# EAGLE design science arm board (EAGLE 7.4.0)
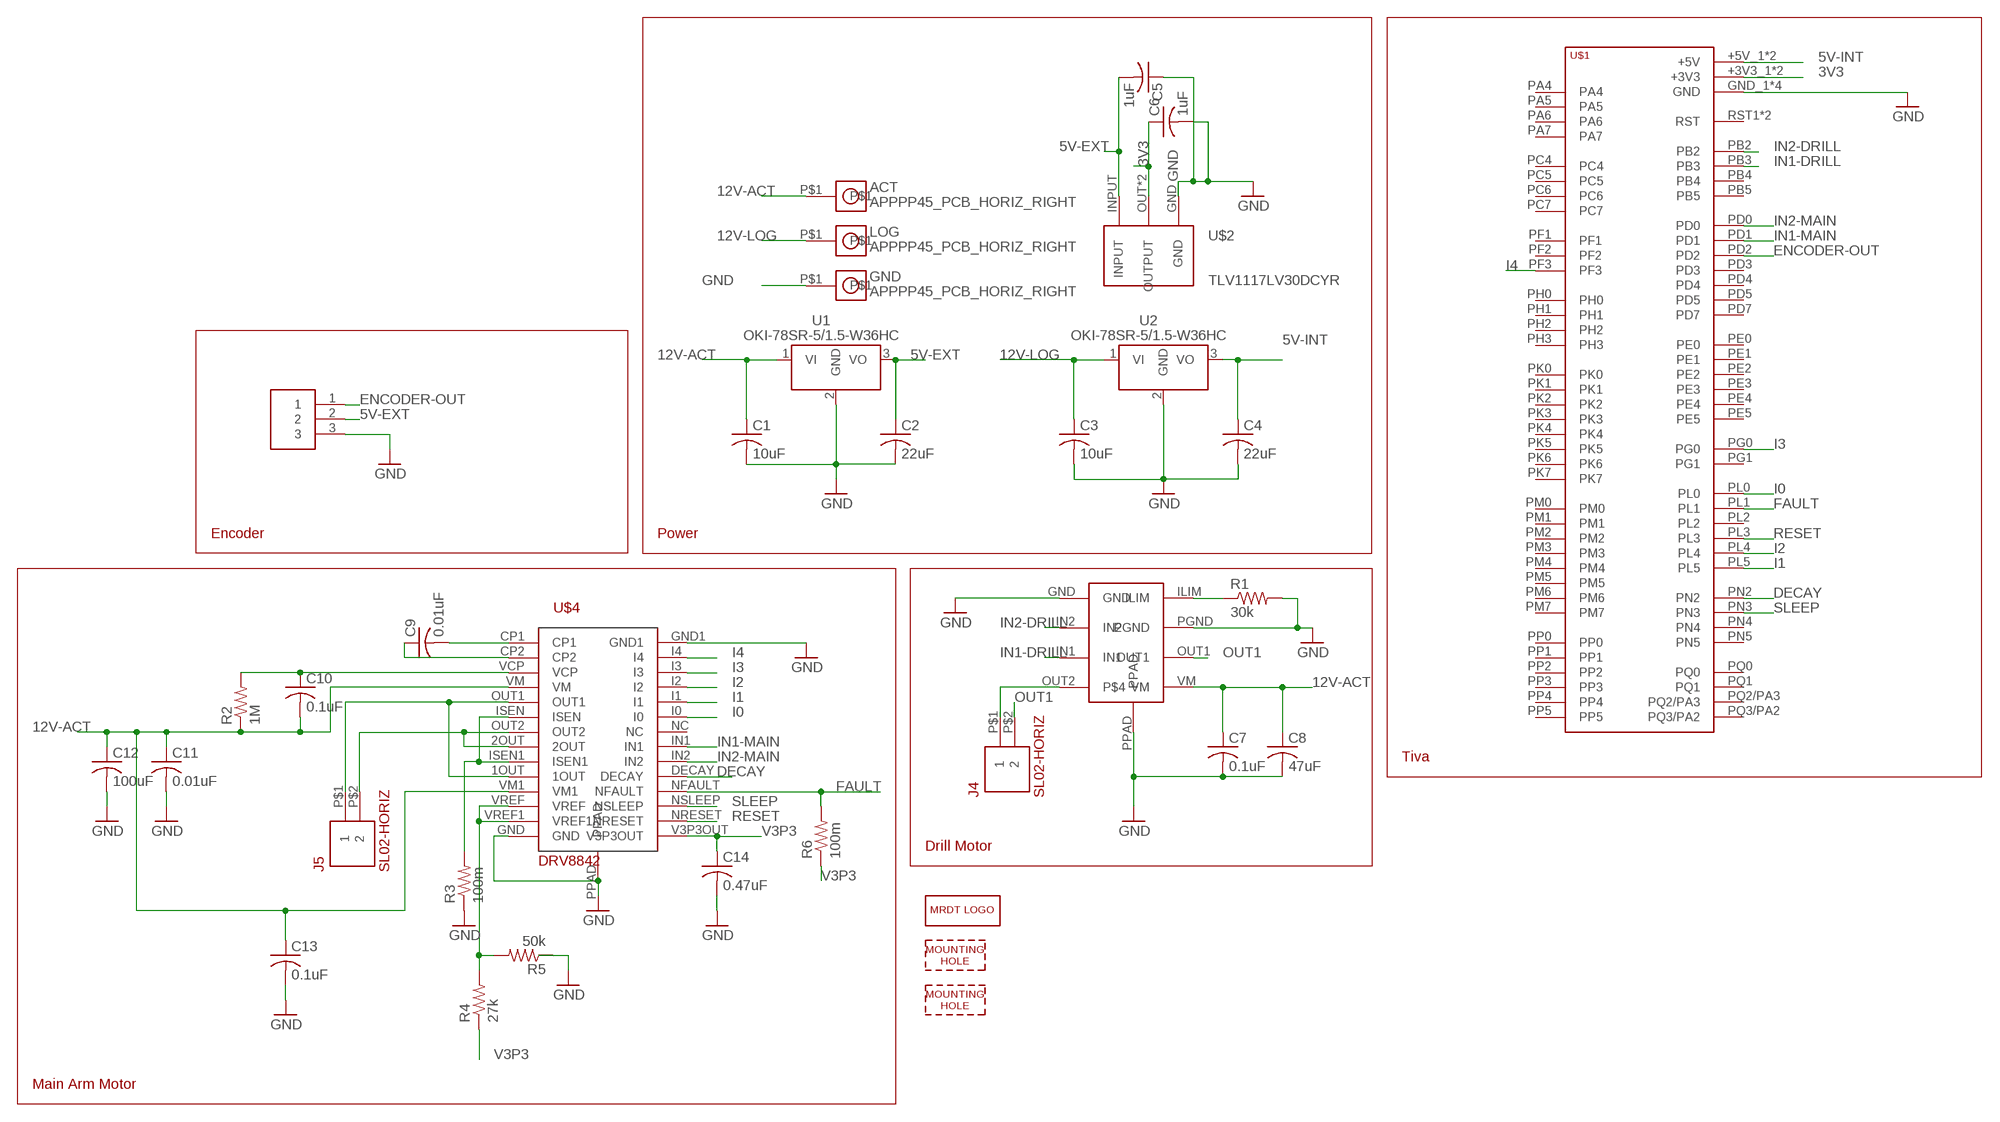
[diagram p0: schematic, sheet 1]

## Parts
ACT  APPPP45_PCB_HORIZ_RIGHT  [APP45_PCB_HORIZ_RIGHT]
C1  10uF  C-USC1206  [C1206]
C2  22uF  C-USC1206  [C1206]
C3  10uF  C-USC1206  [C1206]
C4  22uF  C-USC1206  [C1206]
C5  1uF  C-USC1206  [C1206]
C6  1uF  C-USC1206  [C1206]
C7  0.1uF  C-USC1206  [C1206]
C8  47uF  C-USC1206  [C1206]
C9  0.01uF  C-USC1206  [C1206]
C10  0.1uF  C-USC1206  [C1206]
C11  0.01uF  C-USC1206  [C1206]
C12  100uF  C-USC1206  [C1206]
C13  0.1uF  C-USC1206  [C1206]
C14  0.47uF  C-USC1206  [C1206]
GND  APPPP45_PCB_HORIZ_RIGHT  [APP45_PCB_HORIZ_RIGHT]
H1  MOUNTING_HOLE#6  [#6_SCREW]
H5  MOUNTING_HOLE#6  [#6_SCREW]
J4  SL02-HORIZ  [MOLEX-70551-0001]
J5  SL02-HORIZ  [MOLEX-70551-0001]
J6  SL03THROUGH_HOLE  [MOLEX_SL_03_TH]
LOG  APPPP45_PCB_HORIZ_RIGHT  [APP45_PCB_HORIZ_RIGHT]
LOGO1  MRDT_LOGO  [MRDT_LOGO]
R1  30k  R-US_R0805  [R0805]
R2  1M  R-US_R0805  [R0805]
R3  100m  R-US_R0805  [R0805]
R4  27k  R-US_R0805  [R0805]
R5  50k  R-US_R0805  [R0805]
R6  100m  R-US_R0805  [R0805]
U1  OKI-78SR-5/1.5-W36HC  [OKI-78SR_HORIZ]
U2  OKI-78SR-5/1.5-W36HC  [OKI-78SR_HORIZ]
U$1  TIVA-1294  [TIVA-C-CONNECTED]
U$2  TLV1117LV30DCYR  [TLV1117LV30DCYR]
U$3  DRV8871  [DRV8871]
U$4  DRV8842  [DRV8842]

## Nets
3V3: C6.1 U$1.+3V3_1(+3V3) U$1.+3V3_2(+3V3) U$2.OUT(OUTPUT) U$2.OUTPUT
5V-EXT: C2.1 C5.2 J6.2 U1.3(VO) U$2.INPUT
5V-INT: C4.1 U2.3(VO) U$1.+5V_1(+5V) U$1.+5V_2(+5V)
12V-ACT: ACT.P$1 C1.1 C7.1 C8.1 C10.2 C11.1 C12.1 C13.1 R2.1 U1.1(VI) U$3.VM U$4.VM U$4.VM1
12V-LOG: C3.1 LOG.P$1 U2.1(VI)
DECAY: U$1.PN2 U$4.DECAY
ENCODER-OUT: J6.1 U$1.PD2
FAULT: R6.2 U$1.PL1 U$4.NFAULT
GND: C1.2 C2.2 C3.2 C4.2 C5.1 C6.2 C7.2 C8.2 C11.2 C12.2 C13.2 C14.2 GND.P$1 J6.3 R1.2 R3.1 U1.2(GND) U2.2(GND) U$1.GND_1(GND) U$1.GND_2(GND) U$1.GND_3(GND) U$1.GND_4(GND) U$2.GND U$3.GND U$3.PGND U$3.PPAD U$4.GND U$4.GND1 U$4.PPAD
I0: U$1.PL0 U$4.I0
I1: U$1.PL5 U$4.I1
I2: U$1.PL4 U$4.I2
I3: U$1.PG0 U$4.I3
I4: U$1.PF3 U$4.I4
IN1-DRILL: U$1.PB3 U$3.IN1
IN1-MAIN: U$1.PD1 U$4.IN1
IN2-DRILL: U$1.PB2 U$3.IN2
IN2-MAIN: U$1.PD0 U$4.IN2
N$1: R1.1 U$3.ILIM
N$2: J4.P$1 U$3.OUT2
N$3: R3.2 U$4.ISEN U$4.ISEN1
N$4: J5.P$2 U$4.2OUT U$4.OUT2
N$5: J5.P$1 U$4.1OUT U$4.OUT1
N$6: C9.2 U$4.CP1
N$7: C9.1 U$4.CP2
N$8: C10.1 R2.2 U$4.VCP
N$9: R4.2 R5.2 U$4.VREF U$4.VREF1
OUT1: J4.P$2 U$3.OUT1
RESET: U$1.PL3 U$4.NRESET
SLEEP: U$1.PN3 U$4.NSLEEP
V3P3: C14.1 R4.1 R6.1 U$4.V3P3OUT
Unconnected: R5.1 U$1.PA4 U$1.PA5 U$1.PA6 U$1.PA7 U$1.PB4 U$1.PB5 U$1.PC4 U$1.PC5 U$1.PC6 U$1.PC7 U$1.PD3 U$1.PD4 U$1.PD5 U$1.PD7 U$1.PE0 U$1.PE1 U$1.PE2 U$1.PE3 U$1.PE4 U$1.PE5 U$1.PF1 U$1.PF2 U$1.PG1 U$1.PH0 U$1.PH1 U$1.PH2 U$1.PH3 U$1.PK0 U$1.PK1 U$1.PK2 U$1.PK3 U$1.PK4 U$1.PK5 U$1.PK6 U$1.PK7 U$1.PL2 U$1.PM0 U$1.PM1 U$1.PM2 U$1.PM3 U$1.PM4 U$1.PM5 U$1.PM6 U$1.PM7 U$1.PN4 U$1.PN5 U$1.PP0 U$1.PP1 U$1.PP2 U$1.PP3 U$1.PP4 U$1.PP5 U$1.PQ0 U$1.PQ1 U$1.PQ2/PA3 U$1.PQ3/PA2 U$1.RST1(RST) U$1.RST_2(RST) U$4.NC

## Notes on the sheet
- Encoder | Power
- Tiva
- Drill Motor
- Main Arm Motor

## Library data of the parts
ACT GND LOG = MRDT-Connectors:APP: http://www.powerwerx.com/anderson-powerpoles/
C1-C14 = rcl:C-US: CAPACITOR, American symbol
H1 H5 = MRDT-Hardware:MOUNTING_HOLE: Mounting hole for M6 bolt. Standard use mounting hole for: Tiva C Connected - M6 Anderson Powerpole Mounting Wing - M8 Most frame-mounted PCB's - M8
J4 J5 = MRDT-Connectors:SL02
J6 = MRDT-Connectors:SL03: Molex 3-pin SL connector Locking 3 pin connector with standard header spacing. Backward compatible with standard RC servo connectors.; ORIENT: HORIZ; PARTNO: 0705550002
LOGO1 = MRDT-Hardware:MRDT_LOGO
R1-R6 = rcl:R-US_: RESISTOR, American symbol
U1 U2 = MRDT-ICs:OKI-78SR-*/1.5-W36?C: 4.95W DC/DC Converter Manufacturer: Murata; VOUT: +5v
U$1 = MRDT-Microcontrollers:TIVA-1294: TIVA C CONNECTED LAUNCHPAD
U$2 = ti-voltage-converter-3V3:TLV1117LV30DCYR
U$3 = drill-motor-driver:DRV8871
U$4 = arm-motor-driver:DRV8842

## Board
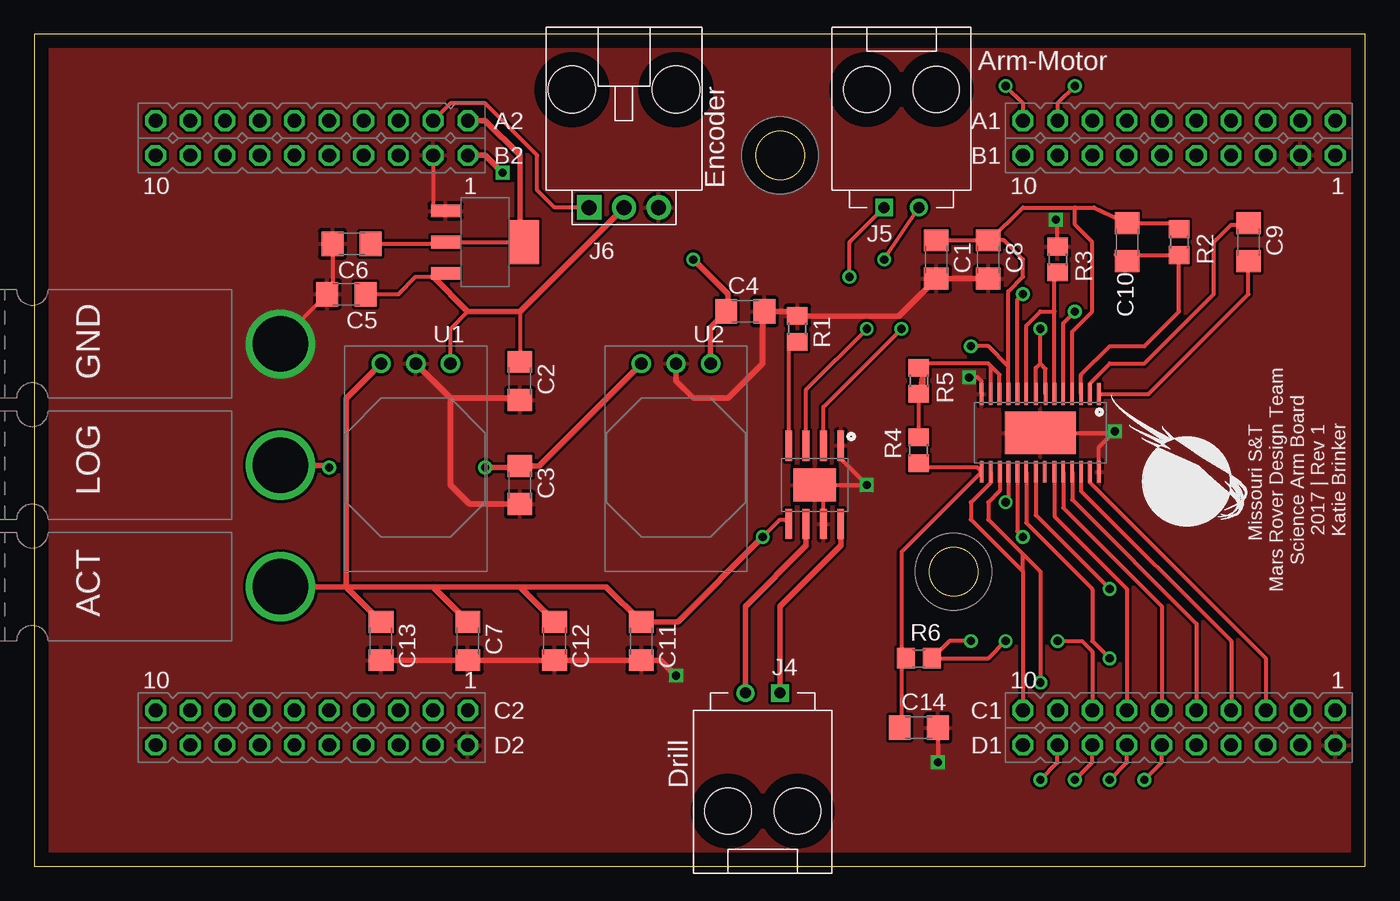
[diagram p1: board, top side]
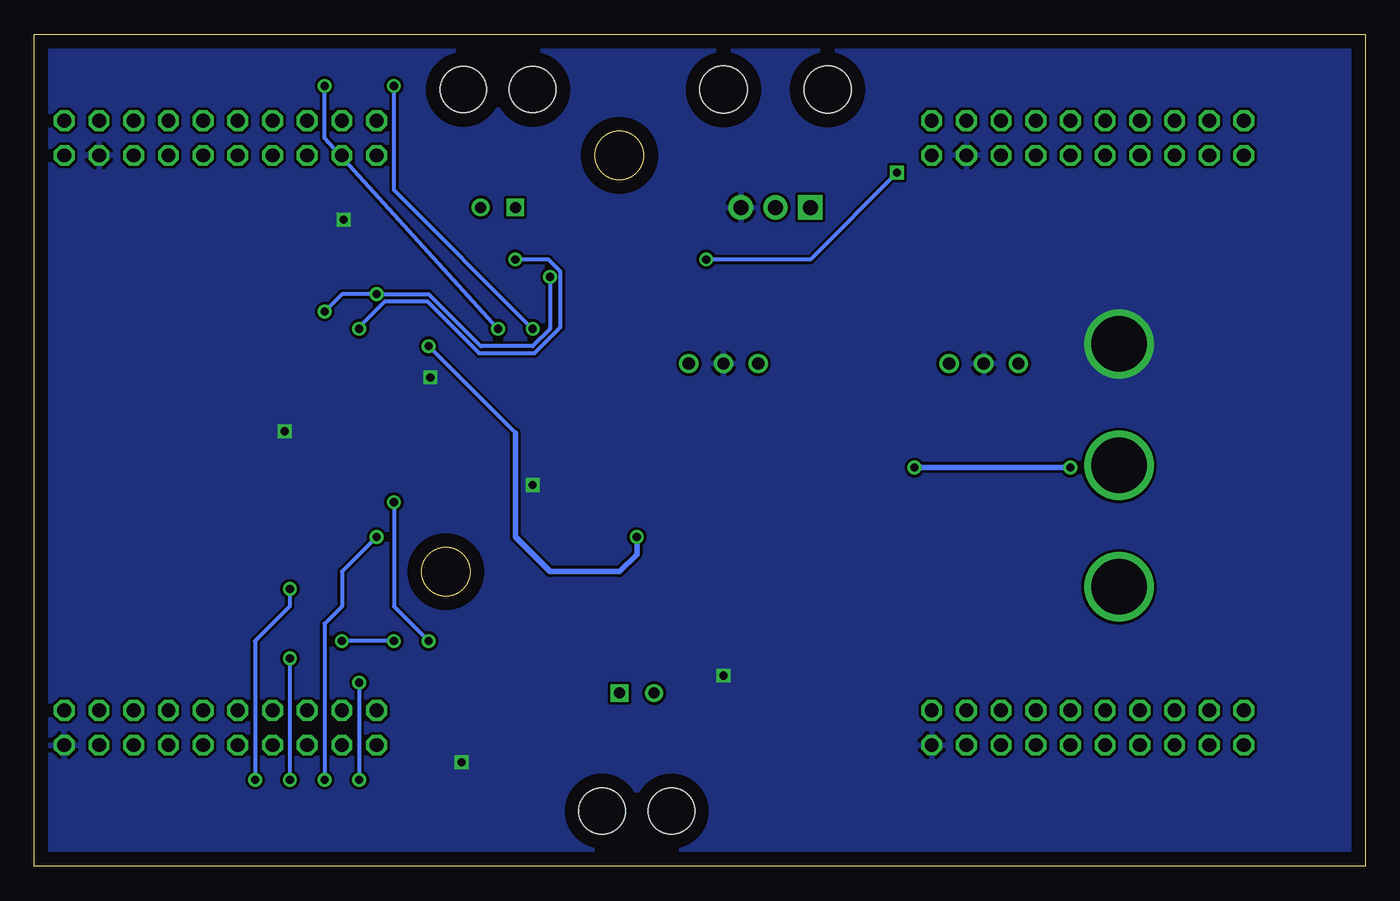
[diagram p2: board, bottom side, seen from below]

Size 97.46 x 60.95 mm. Coordinates in mm from the lower left corner, seen from the top.
Outline: 0,0 97.46,0 97.46,60.95 0,60.95 0,0
Copper layers (1*16): Top 0.035mm / dielectric 1.5mm / Bottom 0.035mm
Design rules "default": minimum track width 10mil, minimum drill 24mil, track to track 8mil, track to pad 8mil, pad to pad 8mil, via to via 8mil, smd to smd 8mil, copper to edge 40mil, drill to drill 8mil, minimum pad ring 10mil, minimum via ring 8mil, stop-mask expansion 4mil, vias tented up to drill 0mil, thermal gap 10mil

### Footprints (pad centres in the part's own frame; a part is rotated, then mirrored left to right if it is on the bottom)
APP45_PCB_HORIZ_RIGHT = drill 4.064: P$1 28.194,3.969
C1206 = smd 1.6 x 1.8: 1 -1.4,0; 2 1.4,0
MOLEX-70551-0001 = drill 0.8 square: P$1 -1.27,0 | drill 0.8: P$2 1.27,0 | hole 3.404: 2.54,8.636; -2.54,8.636
MOLEX_SL_03_TH = drill 1.092 pad 1.778 square: 1 -2.54,0 | drill 1.092 pad 1.778: 2 0,0; 3 2.54,0 | hole 3.454: -3.81,8.636; 3.81,8.636
R0805 = smd 1.3 x 1.5: 1 -0.95,0; 2 0.95,0
OKI-78SR_HORIZ = drill 0.9 pad 1.422: 1 0,0; 2 -2.54,0; 3 -5.08,0
TIVA-C-CONNECTED = drill 1.016 octagon: +3V3_1 59.69,54.61; +3V3_2 123.19,54.61; +5V_1 59.69,52.07; +5V_2 123.19,52.07; GND_1 57.15,52.07; GND_2 59.69,8.89; GND_3 120.65,52.07; GND_4 123.19,8.89; PA4 39.37,52.07; PA5 36.83,52.07; PA6 105.41,52.07; PA7 52.07,8.89; PB2 102.87,54.61; PB3 100.33,54.61; PB4 54.61,52.07; PB5 52.07,52.07; PC4 118.11,54.61; PC5 115.57,54.61; PC6 113.03,54.61; PC7 105.41,54.61; PD0 107.95,8.89; PD1 110.49,8.89; PD2 57.15,54.61; PD3 107.95,54.61; PD4 49.53,54.61; PD5 46.99,54.61; PD7 107.95,52.07; PE0 118.11,52.07; PE1 115.57,52.07; PE2 113.03,52.07; PE3 110.49,52.07; PE4 120.65,54.61; PE5 110.49,54.61; PF1 123.19,11.43; PF2 120.65,11.43; PF3 118.11,11.43; PG0 115.57,11.43; PG1 59.69,11.43; PH0 44.45,11.43; PH1 41.91,11.43; PH2 118.11,8.89; PH3 115.57,8.89; PK0 49.53,52.07; PK1 46.99,52.07; PK2 44.45,52.07; PK3 41.91,52.07; PK4 57.15,11.43; PK5 54.61,11.43; PK6 39.37,11.43; PK7 36.83,11.43; PL0 107.95,11.43; PL1 105.41,11.43; PL2 102.87,11.43; PL3 100.33,11.43; PL4 113.03,11.43; PL5 110.49,11.43; PM0 52.07,11.43; PM1 49.53,11.43; PM2 46.99,11.43; PM3 120.65,8.89; PM4 102.87,52.07; PM5 100.33,52.07; PM6 36.83,8.89; PM7 57.15,8.89; PN2 105.41,8.89; PN3 102.87,8.89; PN4 36.83,54.61; PN5 39.37,54.61; PP0 54.61,54.61; PP1 52.07,54.61; PP2 100.33,8.89; PP3 41.91,8.89; PP4 41.91,54.61; PP5 54.61,8.89; PQ0 44.45,54.61; PQ1 39.37,8.89; PQ2/PA3 46.99,8.89; PQ3/PA2 44.45,8.89; RST1 49.53,8.89; RST_2 113.03,8.89
TLV1117LV30DCYR = smd 0.94 x 2.134: GND 2.286,2.896; INPUT -2.286,2.896; OUTPUT 0,2.896 | smd 3.226 x 2.134: OUT 0,-2.896
DRV8871 = smd 2.2 x 0.5: GND -2.87,1.905; ILIM -2.87,-1.905; IN1 -2.87,-0.635; IN2 -2.87,0.635; OUT1 2.87,-0.635; OUT2 2.87,1.905; PGND 2.87,0.635; VM 2.87,-1.905 | smd 2.4 x 3.099: PPAD 0,0
DRV8842 = smd 1.6 x 0.279: 1OUT -2.845,-1.676; 2OUT -2.845,-0.325; CP1 -2.845,4.293; CP2 -2.845,3.632; DECAY 2.845,-1.676; GND -2.845,-4.293; GND1 2.845,4.293; I0 2.845,1.034; I1 2.845,1.676; I2 2.845,2.337; I3 2.845,2.987; I4 2.845,3.632; IN1 2.845,-0.325; IN2 2.845,-1.034; ISEN -2.845,1.034; ISEN1 -2.845,-1.034; NC 2.845,0.325; NFAULT 2.845,-2.337; NRESET 2.845,-3.632; NSLEEP 2.845,-2.964; OUT1 -2.845,1.676; OUT2 -2.845,0.386; V3P3OUT 2.845,-4.293; VCP -2.845,2.987; VM -2.845,2.337; VM1 -2.845,-2.337; VREF -2.845,-2.987; VREF1 -2.845,-3.632 | smd 3.099 x 5.182: PPAD 0,0

### Placement (x,y rotation side)
ACT  -10.16,16.51 0 top
C1  66.04,44.45 270 top
C2  35.56,35.56 270 top
C3  35.56,27.94 270 top
C4  52.07,40.64 0 top
C5  22.86,41.91 0 top
C6  23.24,45.59 180 top
C7  31.75,16.51 270 top
C8  69.85,44.45 270 top
C9  88.9,45.72 270 top
C10  80.01,45.72 90 top
C11  44.45,16.51 270 top
C12  38.1,16.51 270 top
C13  25.4,16.51 270 top
C14  64.77,10.16 0 top
GND  -10.16,34.29 0 top
H1  54.61,52.07 0 top
H5  67.31,21.59 0 top
J4  53.34,12.7 180 top
J5  63.5,48.26 0 top
J6  43.18,48.26 0 top
LOG  -10.16,25.4 0 top
LOGO1  89.66,24.89 90 top
R1  55.88,39.37 90 top
R2  83.82,45.72 270 top
R3  74.93,44.45 270 top
R4  64.77,30.48 90 top
R5  64.77,35.56 270 top
R6  64.77,15.24 0 top
U1  25.4,36.83 180 top
U2  44.45,36.83 180 top
U$1  -27.94,0 0 top
U$2  33.02,45.72 90 top
U$3  57.15,27.94 270 top
U$4  73.66,31.75 270 top

### Tracks (layer width: path | path; a pad name or v marks a point on that pad's centre or on a via)
3V3
  Top 0.305: 35.56,46.08 35.2,45.72 U$2.OUTPUT 30,45.59 C6.1
  Top 0.406: U$2.OUT 35.56,46.08 35.56,52.07 33.02,54.61 U$1.+3V3_1
5V-EXT
  Top 0.305: C5.2 26.67,41.91 27.94,43.18 29.21,43.18 29.87,43.18 | U1.3 30.48,39.37 31.75,40.64 | 35.56,40.64 C2.1
  Top 0.406: 29.21,43.18 31.75,40.64 35.56,40.64 J6.2 | U$2.INPUT 29.87,43.18
5V-INT  (via drill 0.6)
  Top 0.406: v34.29,50.8 33.02,52.07 U$1.+5V_1 | v48.26,44.45 50.8,41.91 50.8,40.77 C4.1 49.53,39.5 U2.3
  Bottom 0.305: v34.29,50.8 40.64,44.45 v48.26,44.45
12V-ACT  (via drill 0.6)
  Top 0.305: 76.2,48.26 72.39,48.26 69.98,45.85 C8.1 | 76.2,48.26 77.6,48.26 C10.2 83.37,47.12 R2.1 | U$4.VM 76,39.17 77.47,40.64 77.47,45.72 76.2,46.99 76.2,48.26 | v68.58,38.1 69.85,38.1 71.32,36.63 U$4.VM1 71.32,42.11 72.39,43.18 72.39,44.45 70.99,45.85 C8.1 | v53.34,24.13 54.61,25.4 54.91,25.4 U$3.VM | C1.1 C8.1
  Top 0.406: ACT.P$1 22.83,20.48 | 22.83,20.48 C13.1 | 37.97,17.91 C12.1 38.1,17.94 35.56,20.48 | 22.83,20.48 29.21,20.48 | 29.21,20.48 35.56,20.48 | 35.56,20.48 41.88,20.48 C11.1 47.12,17.91 v53.34,24.13 | C7.1 31.75,17.94 29.21,20.48 | 22.83,20.48 22.83,34.26 U1.1
  Bottom 0.305: v68.58,38.1 62.23,31.75
  Bottom 0.406: v53.34,24.13 53.34,22.86 54.61,21.59 59.69,21.59 62.23,24.13 62.23,31.75
12V-LOG  (via drill 0.6)
  Top 0.406: LOG.P$1 21.43,29.37 v21.59,29.21 | v33.02,29.21 35.43,29.21 C3.1 36.96,29.34 U2.1
  Bottom 0.406: v21.59,29.21 v33.02,29.21
DECAY  (via drill 0.6)
  Top 0.305: U$4.DECAY 71.98,24.54 v72.39,24.13 | v76.2,6.35 77.47,7.62 U$1.PN2
  Bottom 0.305: v72.39,24.13 74.93,21.59 74.93,19.05 76.2,17.78 v76.2,6.35
ENCODER-OUT
  Top 0.305: U$1.PD2 30.48,55.88 33.02,55.88 36.83,52.07 36.83,49.53 38.1,48.26 J6.1
FAULT  (via drill 0.6)
  Top 0.305: U$4.NFAULT 71.32,26.87 v71.12,26.67 | v68.58,16.51 66.99,16.51 R6.2 69.85,15.24 v71.12,16.51 | v74.93,16.51 76.71,16.51 77.47,15.75 U$1.PL1
  Bottom 0.305: v71.12,26.67 71.12,19.05 v68.58,16.51 | v71.12,16.51 v74.93,16.51
GND  (via drill 0.6)
  Top 0.305: 77.95,28.73 U$4.GND1 77.95,30.71 v79.12,31.88 78.99,31.75 U$4.PPAD 71.25,31.75 | U$3.PPAD 58.42,27.94 | U$3.PGND 57.78,27.3 58.42,27.94 | R3.1 74.93,47.24 v74.8,47.37 | 58.42,27.94 v60.96,27.94 59.05,29.84 U$3.GND | C14.2 v66.17,7.62 | U$1.GND_1 29.21,48.26 29.46,48.01 U$2.GND | GND.P$1 18.03,38.48 C5.1 | C5.1 21.46,42.67 | U$4.GND 69.37,35.53 69.09,35.81 v68.45,35.81 | C6.2 21.84,42.29 C5.1
  Top 0.406: C13.2 C7.2 C12.2 C11.2 45.85,15.11 v46.99,13.97 | U1.2 30.48,34.29 | 30.48,34.29 35.43,34.29 C2.2 | C3.2 31.88,26.54 30.48,27.94 30.48,34.29 | U2.2 46.99,35.56 48.26,34.29 50.8,34.29 53.34,36.83 53.34,40.51 C4.2 55.56,40.64 R1.2 63.31,40.32 C1.2 C8.2
  pour Bottom: -10.16,67.31 -10.16,-6.35 106.68,-6.35 106.68,68.58 -10.16,68.58
  pour Top: 0.25,61.34 0.13,61.34 0.13,-1.52 97.54,-1.52 97.54,61.59 0.13,61.59 0.13,61.21 0.13,61.09
I0
  Top 0.305: U$4.I0 74.69,25.64 80.01,20.32 U$1.PL0
I1
  Top 0.305: U$4.I1 75.34,26.26 82.55,19.05 U$1.PL5
I2
  Top 0.305: U$4.I2 76,26.87 85.09,17.78 U$1.PL4
I3
  Top 0.305: U$4.I3 76.65,27.49 87.63,16.51 U$1.PG0
I4
  Top 0.305: U$4.I4 77.29,28.12 90.17,15.24 U$1.PF3
IN1-DRILL  (via drill 0.6)
  Top 0.305: U$3.IN1 56.51,34.92 v60.96,39.37 | v71.12,57.15 72.39,55.88 U$1.PB3
  Bottom 0.305: v60.96,39.37 71.12,49.53 v71.12,57.15
IN1-MAIN  (via drill 0.6)
  Top 0.305: v81.28,6.35 82.55,7.62 U$1.PD1 | v78.74,20.32 73.34,25.73 U$4.IN1
  Bottom 0.305: v78.74,20.32 78.74,19.05 81.28,16.51 v81.28,6.35
IN2-DRILL  (via drill 0.6)
  Top 0.305: U$3.IN2 57.78,33.66 v63.5,39.37 | v76.2,57.15 74.93,55.88 U$1.PB2
  Bottom 0.305: v63.5,39.37 76.2,53.34 v76.2,57.15
IN2-MAIN  (via drill 0.6)
  Top 0.305: U$4.IN2 72.63,25.16 77.47,20.32 77.47,16.51 v78.74,15.24 | v78.74,6.35 80.01,7.62 U$1.PD0
  Bottom 0.305: v78.74,15.24 v78.74,6.35
N$1
  Top 0.305: U$3.ILIM 55.24,37.78 R1.1
N$2
  Top 0.406: J4.P$1 54.61,19.05 59.05,23.5 U$3.OUT2
N$3
  Top 0.305: U$4.ISEN 74.69,40.64 | U$4.ISEN1 72.63,39.61 73.66,40.64 74.69,40.64 | 74.69,40.64 74.69,43.26 R3.2
N$4  (via drill 0.6)
  Top 0.305: U$4.2OUT 73.34,36.51 73.66,36.83 | 73.66,36.83 v73.66,39.37 | U$4.OUT2 74.05,36.44 73.66,36.83 | v62.23,44.45 J5.P$2
  Bottom 0.305: v73.66,39.37 73.66,39.5 71.76,41.4 68.71,41.4 64.9,37.59 60.83,37.59 58.93,39.5 58.93,43.56 59.82,44.45 v62.23,44.45
N$5  (via drill 0.6)
  Top 0.305: U$4.1OUT 71.98,41.5 v72.39,41.91 | U$4.OUT1 75.34,39.78 v76.2,40.64 | v59.69,43.18 59.69,45.72 J5.P$1
  Bottom 0.305: v76.2,40.64 74.93,41.91 v72.39,41.91 68.58,41.91 64.77,38.1 60.96,38.1 59.69,39.37 v59.69,43.18
N$6
  Top 0.305: U$4.CP1 81.59,34.59 88.9,41.91 C9.2
N$7
  Top 0.305: U$4.CP2 77.29,35.38 78.74,36.83 81.28,36.83 86.36,41.91 86.36,45.72 87.63,46.99 88.77,46.99 C9.1
N$8
  Top 0.305: U$4.VCP 76.65,36.01 78.74,38.1 81.28,38.1 83.82,40.64 R2.2 79.19,44.77 C10.1
N$9
  Top 0.305: U$4.VREF1 70.03,36.65 | 70.03,36.65 69.85,36.83 65.09,36.83 | 65.09,36.83 R5.2 R4.2 | U$4.VREF 70.67,36.01 70.03,36.65 | 65.09,36.83 65.09,34.29
OUT1
  Top 0.406: J4.P$2 52.07,19.05 56.51,23.5 U$3.OUT1
RESET
  Top 0.305: 72.39,21.59 U$1.PL3 | U$4.NRESET 70.03,28.12 68.58,26.67 68.58,25.4 72.39,21.59 | 72.39,21.59 72.39,22.86
SLEEP  (via drill 0.6)
  Top 0.305: v73.66,6.35 74.93,7.62 U$1.PN3 | U$4.NSLEEP 70.7,27.52 69.85,26.67 69.85,25.4 73.66,21.59 v73.66,13.46
  Bottom 0.305: v73.66,13.46 v73.66,6.35
V3P3
  Top 0.305: 63.5,15.24 63.37,15.11 | 63.5,15.56 63.5,23.04 U$4.V3P3OUT 69.06,29.21 65.09,29.21 R4.1 | 63.5,15.56 R6.1 | 63.5,15.24 63.5,10.29 C14.1 | 63.5,15.56 63.5,15.24

### Text on the board
tPlace: Arm-Motor | Encoder | GND | LOG | ACT | Drill
tNames: Missouri S&T / Mars Rover Design Team / Science Arm Board / 2017 | Rev 1 / Katie Brinker